# Altium schematic sheet OUTL.SchDoc
size A4
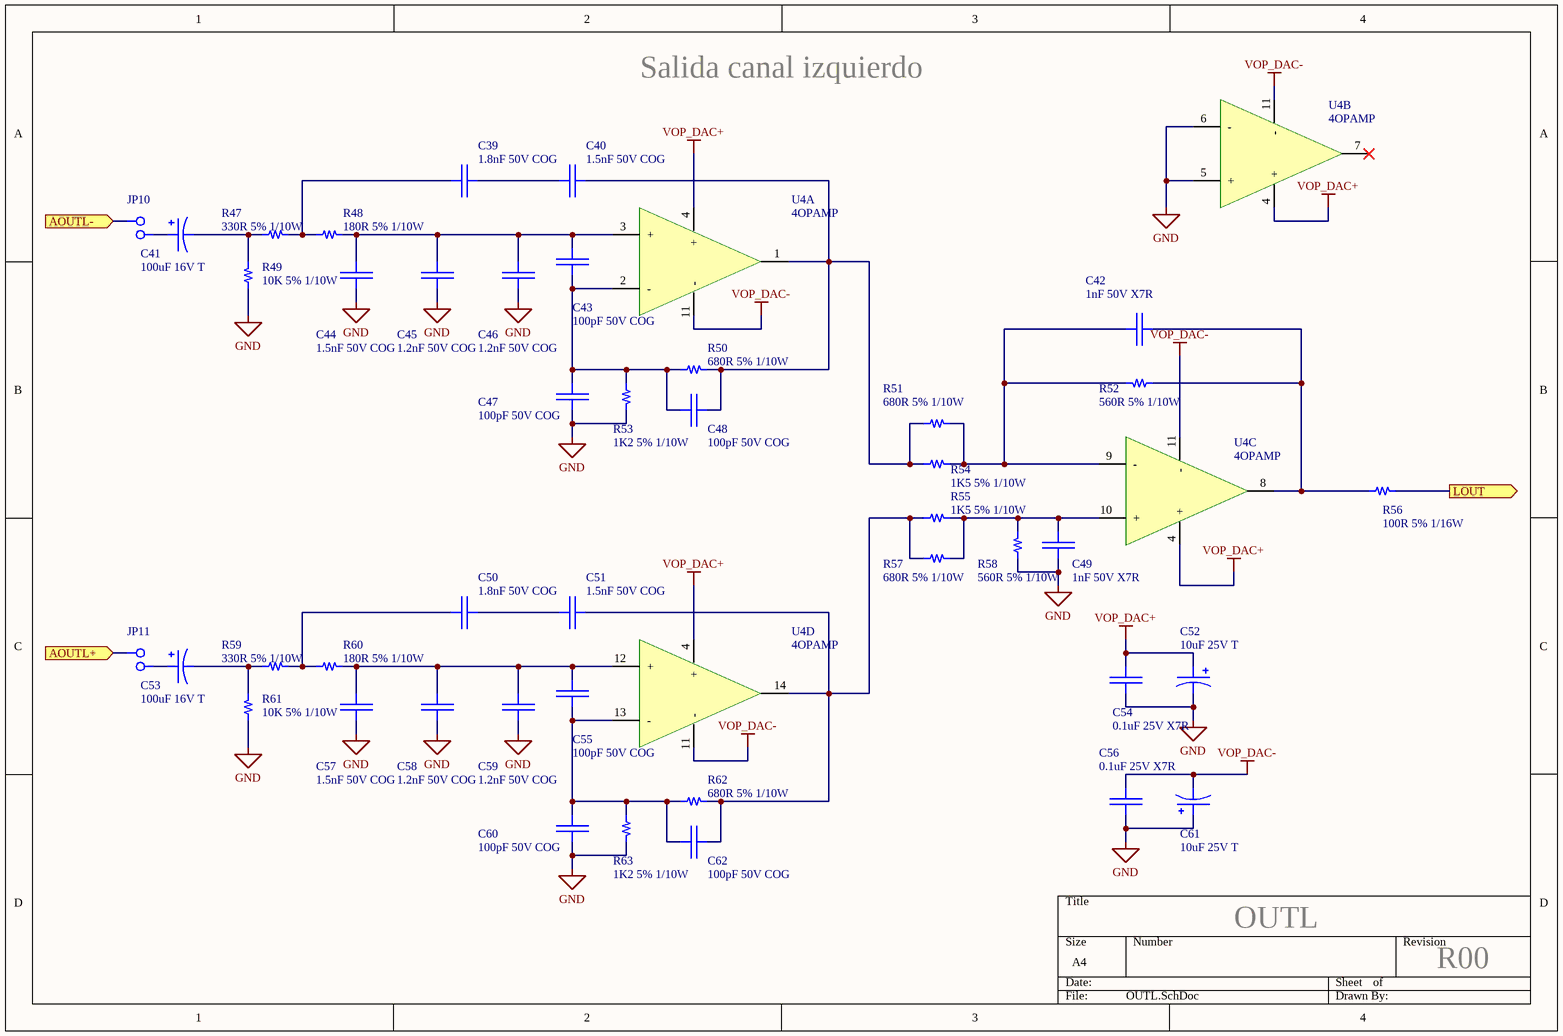
[diagram p0: OUTL.SchDoc]

## Parts
C39  1.8nF 50V COG  [C_0805]
C40  1.5nF 50V COG  [C_0805]
C41  100uF 16V T  [TANT]
C42  1nF 50V X7R  [C_0805]
C43  100pF 50V COG  [C_0805]
C44  1.5nF 50V COG  [C_0805]
C45  1.2nF 50V COG  [C_0805]
C46  1.2nF 50V COG  [C_0805]
C47  100pF 50V COG  [C_0805]
C48  100pF 50V COG  [C_0805]
C49  1nF 50V X7R  [C_0805]
C50  1.8nF 50V COG  [C_0805]
C51  1.5nF 50V COG  [C_0805]
C52  10uF 25V T  [TANT]
C53  100uF 16V T  [TANT]
C54  0.1uF 25V X7R  [C_0805]
C55  100pF 50V COG  [C_0805]
C56  0.1uF 25V X7R  [C_0805]
C57  1.5nF 50V COG  [C_0805]
C58  1.2nF 50V COG  [C_0805]
C59  1.2nF 50V COG  [C_0805]
C60  100pF 50V COG  [C_0805]
C61  10uF 25V T  [TANT]
C62  100pF 50V COG  [C_0805]
JP10  Jumper 2x1  [Conn_2_1]  (value not drawn)
JP11  Jumper 2x1  [Conn_2_1]  (value not drawn)
R47  330R 5% 1/10W  [R_0805]
R48  180R 5% 1/10W  [R_0805]
R49  10K 5% 1/10W  [R_0805]
R50  680R 5% 1/10W  [R_0805]
R51  680R 5% 1/10W  [R_0805]
R52  560R 5% 1/10W  [R_0805]
R53  1K2 5% 1/10W  [R_0805]
R54  1K5 5% 1/10W  [R_0805]
R55  1K5 5% 1/10W  [R_0805]
R56  100R 5% 1/16W  [R_0805]
R57  680R 5% 1/10W  [R_0805]
R58  560R 5% 1/10W  [R_0805]
R59  330R 5% 1/10W  [R_0805]
R60  180R 5% 1/10W  [R_0805]
R61  10K 5% 1/10W  [R_0805]
R62  680R 5% 1/10W  [R_0805]
R63  1K2 5% 1/10W  [R_0805]
U4  4OPAMP  [SOIC14]  (parts A,B,C,D of 4)

## Ports
AOUTL+ (in), AOUTL- (in), LOUT (out)

## Nets
GND: C44.1 C45.1 C46.1 C47.2 C49.2 C52.2 C54.2 C56.2 C57.1 C58.1 C59.1 C60.2 C61.1 R49.1 R53.2 R58.1 R61.1 R63.2 U4.5(+) U4.6(-)
VOP_DAC+: C52.1 C54.1 U4.4(+)
VOP_DAC-: C56.1 C61.2 U4.11(-)
AOUTL+: JP11.1 ; port AOUTL+
AOUTL-: JP10.1 ; port AOUTL-
LOUT: R56.2 ; port LOUT
NetC39_1: C39.1 C40.2
NetC39_2: C39.2 R47.2 R48.1
NetC40_1: C40.1 C48.2 R50.2 R51.1 R54.1 U4.1(OUT)
NetC41_1: C41.1 JP10.2
NetC41_2: C41.2 R47.1 R49.2
NetC42_1: C42.1 R51.2 R52.2 R54.2 U4.9(-)
NetC42_2: C42.2 R52.1 R56.1 U4.8(OUT)
NetC43_1: C43.1 C44.2 C45.2 C46.2 R48.2 U4.3(+)
NetC43_2: C43.2 C47.1 C48.1 R50.1 R53.1 U4.2(-)
NetC49_1: C49.1 R55.2 R57.2 R58.2 U4.10(+)
NetC50_1: C50.1 C51.2
NetC50_2: C50.2 R59.2 R60.1
NetC51_1: C51.1 C62.2 R55.1 R57.1 R62.2 U4.14(OUT)
NetC53_1: C53.1 JP11.2
NetC53_2: C53.2 R59.1 R61.2
NetC55_1: C55.1 C57.2 C58.2 C59.2 R60.2 U4.12(+)
NetC55_2: C55.2 C60.1 C62.1 R62.1 R63.1 U4.13(-)

Not connected (* = marked no-connect by the designer): U4 7(OUT)*

## Notes on the sheet
- Salida canal izquierdo
- OUTL
- R00

## Library data of the parts
C39 C40 C44-C46 C50 C51 C57-C59 = Capacitor: Capacitor de placas paralelas; Encapsulado: 0805; Cod. Proveedor: -; Proveedor: -
C41 C52 C53 C61 = CapaPol: Capacitor polarizado; Encapsulado: TH; Cod. Proveedor: -; Proveedor: -
C42 C49 = Capacitor: Capacitor de placas paralelas; Cod. Proveedor: CA3289020; Encapsulado: 0603; Proveedor: Elemon
C43 C47 C48 C55 C60 C62 = Capacitor: Capacitor de placas paralelas; Cod. Proveedor: CA3288850; Encapsulado: 0603; Proveedor: Elemon
C54 C56 = Capacitor: Capacitor de placas paralelas; Cod. Proveedor: CA3289100; Encapsulado: 0603; Proveedor: Elemon
R47 R59 = Resistor: Resistencia; Cod. Proveedor: RS3896155; Encapsulado: 0805; Proveedor: Elemon
R48 R60 = Resistor: Resistencia; Cod. Proveedor: RS3896140; Encapsulado: 0805; Proveedor: Elemon
R49-R51 R53-R55 R57 R61-R63 = Resistor: Resistencia; Encapsulado: 0805; Cod. Proveedor: -; Proveedor: -
R52 = Resistor: Resistencia; Cod. Proveedor: RS3896170; Encapsulado: 0805; Proveedor: Elemon
R56 = Resistor: Resistencia; Cod. Proveedor: RS3866125; Encapsulado: 0603; Proveedor: Elemon
R58 = Resistor: Resistencia
U4 = 4OPAMP: Integrado con 4 operacionales